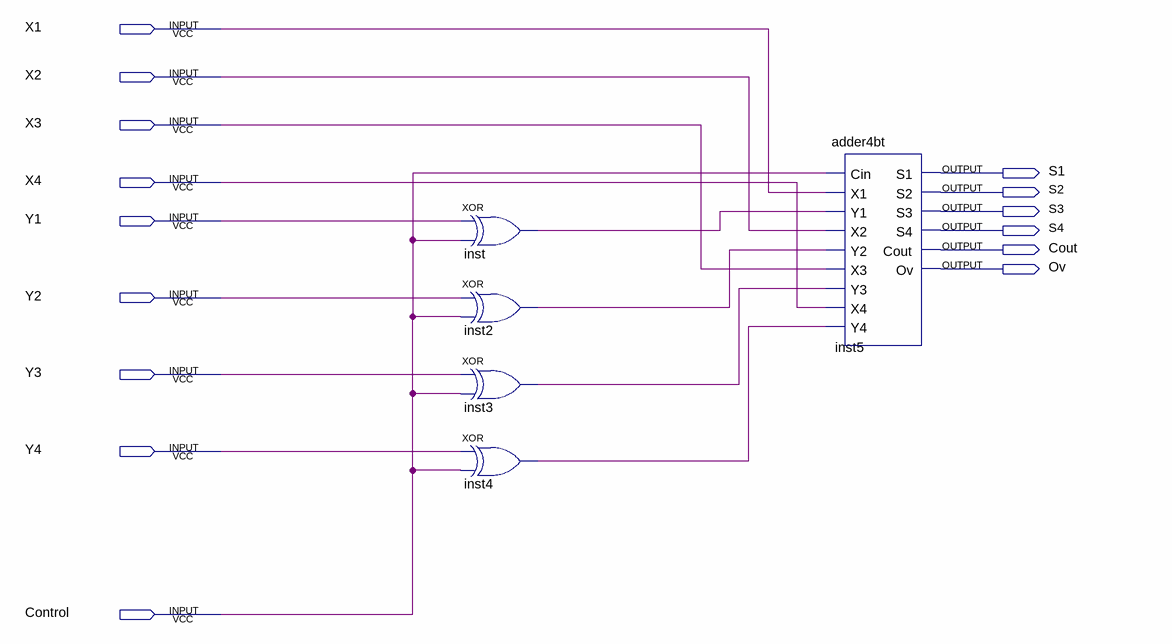
[diagram p0: schematic sheet]
// Quartus schematic signedAdder.bdf as structural Verilog: 5 symbols, 15 pins
module signedAdder (
  input  X1,
  input  X2,
  input  X3,
  input  X4,
  input  Y1,
  input  Y2,
  input  Y3,
  input  Y4,
  input  Control,
  output S1,
  output S2,
  output S3,
  output S4,
  output Cout,
  output Ov
);

  wire inst2_out, inst3_out, inst4_out, inst_out;

  xor inst (inst_out, Y1, Control);
  xor inst2 (inst2_out, Y2, Control);
  xor inst3 (inst3_out, Y3, Control);
  xor inst4 (inst4_out, Y4, Control);
  adder4bt inst5 (
    .Cin(Control), .X1(X1), .Y1(inst_out), .X2(X2), .Y2(inst2_out), .X3(X3), .Y3(inst3_out), .X4(X4),
    .Y4(inst4_out), .S1(S1), .S2(S2), .S3(S3), .S4(S4), .Cout(Cout), .Ov(Ov));
endmodule
